# Altium schematic sheet xpoint.SchDoc
size A3
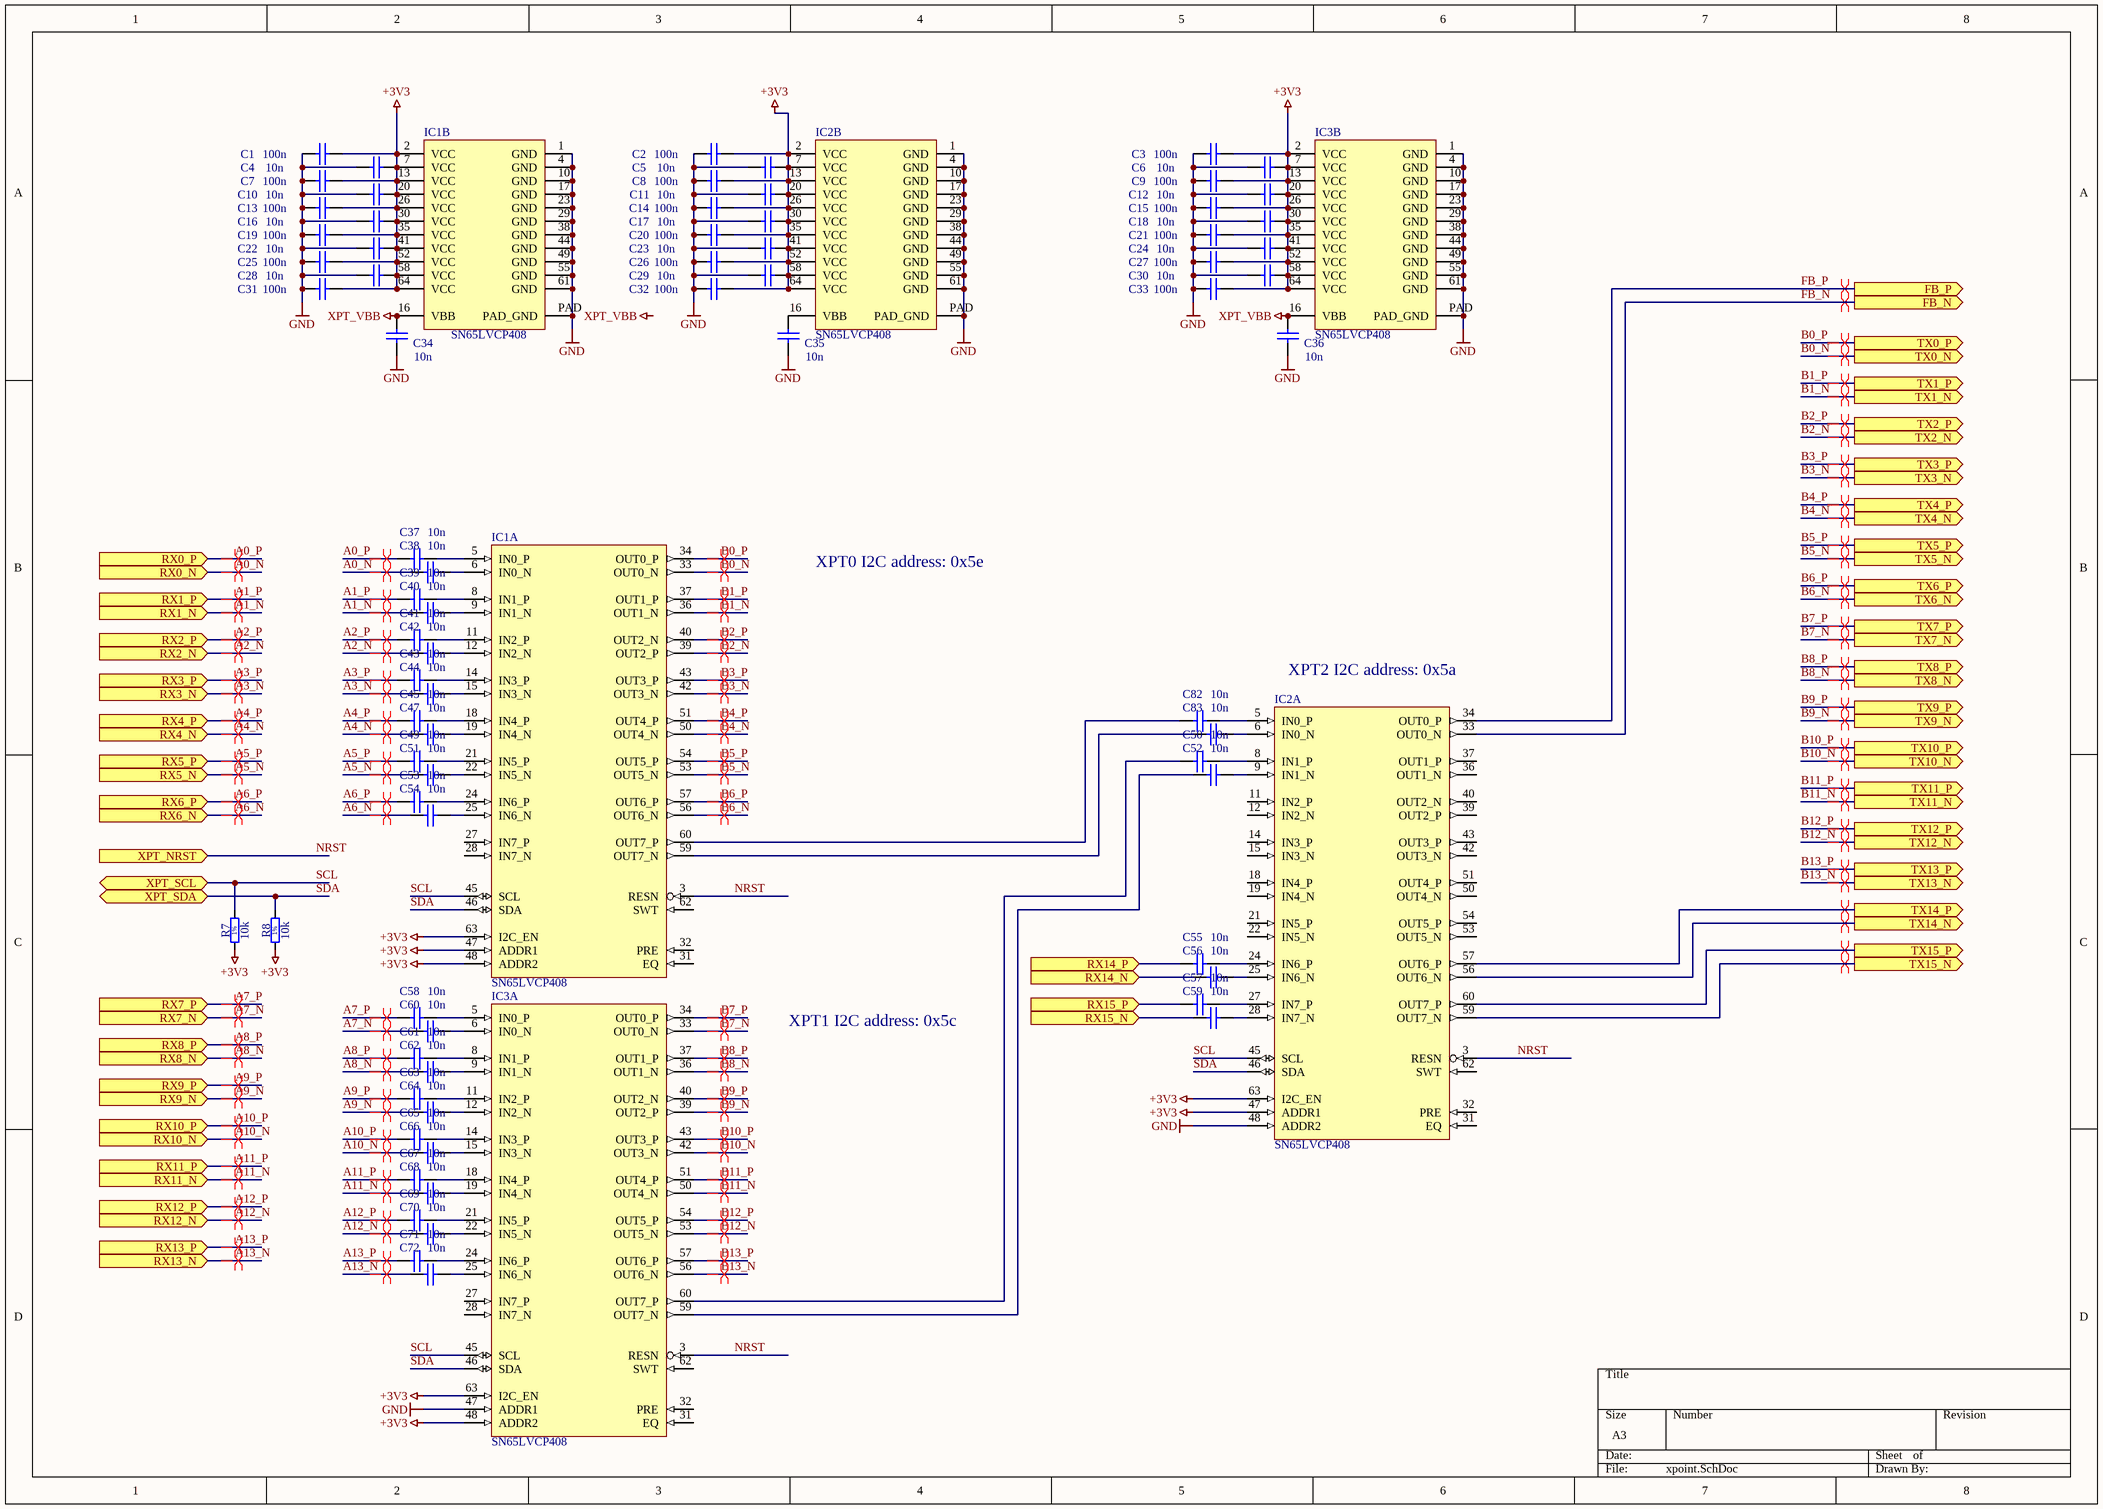
[diagram p0: xpoint.SchDoc]

## Parts
C1  100n  [CAPC1608X87N]
C2  100n  [CAPC1608X87N]
C3  100n  [CAPC1608X87N]
C4  10n  [CAPC1608X87N]
C5  10n  [CAPC1608X87N]
C6  10n  [CAPC1608X87N]
C7  100n  [CAPC1608X87N]
C8  100n  [CAPC1608X87N]
C9  100n  [CAPC1608X87N]
C10  10n  [CAPC1608X87N]
C11  10n  [CAPC1608X87N]
C12  10n  [CAPC1608X87N]
C13  100n  [CAPC1608X87N]
C14  100n  [CAPC1608X87N]
C15  100n  [CAPC1608X87N]
C16  10n  [CAPC1608X87N]
C17  10n  [CAPC1608X87N]
C18  10n  [CAPC1608X87N]
C19  100n  [CAPC1608X87N]
C20  100n  [CAPC1608X87N]
C21  100n  [CAPC1608X87N]
C22  10n  [CAPC1608X87N]
C23  10n  [CAPC1608X87N]
C24  10n  [CAPC1608X87N]
C25  100n  [CAPC1608X87N]
C26  100n  [CAPC1608X87N]
C27  100n  [CAPC1608X87N]
C28  10n  [CAPC1608X87N]
C29  10n  [CAPC1608X87N]
C30  10n  [CAPC1608X87N]
C31  100n  [CAPC1608X87N]
C32  100n  [CAPC1608X87N]
C33  100n  [CAPC1608X87N]
C34  10n  [CAPC1608X87N]
C35  10n  [CAPC1608X87N]
C36  10n  [CAPC1608X87N]
C37  10n  [CAPC1608X87N]
C38  10n  [CAPC1608X87N]
C39  10n  [CAPC1608X87N]
C40  10n  [CAPC1608X87N]
C41  10n  [CAPC1608X87N]
C42  10n  [CAPC1608X87N]
C43  10n  [CAPC1608X87N]
C44  10n  [CAPC1608X87N]
C45  10n  [CAPC1608X87N]
C47  10n  [CAPC1608X87N]
C49  10n  [CAPC1608X87N]
C50  10n  [CAPC1608X87N]
C51  10n  [CAPC1608X87N]
C52  10n  [CAPC1608X87N]
C53  10n  [CAPC1608X87N]
C54  10n  [CAPC1608X87N]
C55  10n  [CAPC1608X87N]
C56  10n  [CAPC1608X87N]
C57  10n  [CAPC1608X87N]
C58  10n  [CAPC1608X87N]
C59  10n  [CAPC1608X87N]
C60  10n  [CAPC1608X87N]
C61  10n  [CAPC1608X87N]
C62  10n  [CAPC1608X87N]
C63  10n  [CAPC1608X87N]
C64  10n  [CAPC1608X87N]
C65  10n  [CAPC1608X87N]
C66  10n  [CAPC1608X87N]
C67  10n  [CAPC1608X87N]
C68  10n  [CAPC1608X87N]
C69  10n  [CAPC1608X87N]
C70  10n  [CAPC1608X87N]
C71  10n  [CAPC1608X87N]
C72  10n  [CAPC1608X87N]
C82  10n  [CAPC1608X87N]
C83  10n  [CAPC1608X87N]
IC1  SN65LVCP408  [HTQFP64]  (parts A,B of 2)
IC2  SN65LVCP408  [HTQFP64]  (parts A,B of 2)
IC3  SN65LVCP408  [HTQFP64]  (parts A,B of 2)
R7  10k  [RESC1608X55N]
R8  10k  [RESC1608X55N]

## Ports
FB_N (out), FB_P (out), RX0_N (in), RX0_P (in), RX1_N (in), RX1_P (in), RX2_N (in), RX2_P (in), RX3_N (in), RX3_P (in), RX4_N (in), RX4_P (in), RX5_N (in), RX5_P (in), RX6_N (in), RX6_P (in), RX7_N (in), RX7_P (in), RX8_N (in), RX8_P (in), RX9_N (in), RX9_P (in), RX10_N (in), RX10_P (in), RX11_N (in), RX11_P (in), RX12_N (in), RX12_P (in), RX13_N (in), RX13_P (in), RX14_N (in), RX14_P (in), RX15_N (in), RX15_P (in), TX0_N (out), TX0_P (out), TX1_N (out), TX1_P (out), TX2_N (out), TX2_P (out), TX3_N (out), TX3_P (out), TX4_N (out), TX4_P (out), TX5_N (out), TX5_P (out), TX6_N (out), TX6_P (out), TX7_N (out), TX7_P (out), TX8_N (out), TX8_P (out), TX9_N (out), TX9_P (out), TX10_N (out), TX10_P (out), TX11_N (out), TX11_P (out), TX12_N (out), TX12_P (out), TX13_N (out), TX13_P (out), TX14_N (out), TX14_P (out), TX15_N (out), TX15_P (out), XPT_NRST (in), XPT_SCL (bidir), XPT_SDA (bidir)

## Nets
+3V3: C1.2 C2.2 C3.2 C4.2 C5.2 C6.2 C7.2 C8.2 C9.2 C10.2 C11.2 C12.2 C13.2 C14.2 C15.2 C16.2 C17.2 C18.2 C19.2 C20.2 C21.2 C22.2 C23.2 C24.2 C25.2 C26.2 C27.2 C28.2 C29.2 C30.2 C31.2 C32.2 C33.2 IC1.2(VCC) IC1.7(VCC) IC1.13(VCC) IC1.20(VCC) IC1.26(VCC) IC1.30(VCC) IC1.35(VCC) IC1.41(VCC) IC1.47(ADDR1) IC1.48(ADDR2) IC1.52(VCC) IC1.58(VCC) IC1.63(I2C_EN) IC1.64(VCC) IC2.2(VCC) IC2.7(VCC) IC2.13(VCC) IC2.20(VCC) IC2.26(VCC) IC2.30(VCC) IC2.35(VCC) IC2.41(VCC) IC2.47(ADDR1) IC2.52(VCC) IC2.58(VCC) IC2.63(I2C_EN) IC2.64(VCC) IC3.2(VCC) IC3.7(VCC) IC3.13(VCC) IC3.20(VCC) IC3.26(VCC) IC3.30(VCC) IC3.35(VCC) IC3.41(VCC) IC3.48(ADDR2) IC3.52(VCC) IC3.58(VCC) IC3.63(I2C_EN) IC3.64(VCC) R7.1 R8.1
GND: C1.1 C2.1 C3.1 C4.1 C5.1 C6.1 C7.1 C8.1 C9.1 C10.1 C11.1 C12.1 C13.1 C14.1 C15.1 C16.1 C17.1 C18.1 C19.1 C20.1 C21.1 C22.1 C23.1 C24.1 C25.1 C26.1 C27.1 C28.1 C29.1 C30.1 C31.1 C32.1 C33.1 C34.1 C35.1 C36.1 IC1.1(GND) IC1.4(GND) IC1.10(GND) IC1.17(GND) IC1.23(GND) IC1.29(GND) IC1.38(GND) IC1.44(GND) IC1.49(GND) IC1.55(GND) IC1.61(GND) IC1.PAD(PAD_GND) IC2.1(GND) IC2.4(GND) IC2.10(GND) IC2.17(GND) IC2.23(GND) IC2.29(GND) IC2.38(GND) IC2.44(GND) IC2.48(ADDR2) IC2.49(GND) IC2.55(GND) IC2.61(GND) IC2.PAD(PAD_GND) IC3.1(GND) IC3.4(GND) IC3.10(GND) IC3.17(GND) IC3.23(GND) IC3.29(GND) IC3.38(GND) IC3.44(GND) IC3.47(ADDR1) IC3.49(GND) IC3.55(GND) IC3.61(GND) IC3.PAD(PAD_GND)
XPT_VBB: C34.2 C36.2 IC1.16(VBB) IC3.16(VBB)
A0_N: C38.1 ; port RX0_N
A0_P: C37.1 ; port RX0_P
A1_N: C40.1 ; port RX1_N
A1_P: C39.1 ; port RX1_P
A2_N: C42.1 ; port RX2_N
A2_P: C41.1 ; port RX2_P
A3_N: C44.1 ; port RX3_N
A3_P: C43.1 ; port RX3_P
A4_N: C47.1 ; port RX4_N
A4_P: C45.1 ; port RX4_P
A5_N: C51.1 ; port RX5_N
A5_P: C49.1 ; port RX5_P
A6_N: C54.1 ; port RX6_N
A6_P: C53.1 ; port RX6_P
A7_N: C60.1 ; port RX7_N
A7_P: C58.1 ; port RX7_P
A8_N: C62.1 ; port RX8_N
A8_P: C61.1 ; port RX8_P
A9_N: C64.1 ; port RX9_N
A9_P: C63.1 ; port RX9_P
A10_N: C66.1 ; port RX10_N
A10_P: C65.1 ; port RX10_P
A11_N: C68.1 ; port RX11_N
A11_P: C67.1 ; port RX11_P
A12_N: C70.1 ; port RX12_N
A12_P: C69.1 ; port RX12_P
A13_N: C72.1 ; port RX13_N
A13_P: C71.1 ; port RX13_P
B0_N: IC1.33(OUT0_N) ; port TX0_N
B0_P: IC1.34(OUT0_P) ; port TX0_P
B1_N: IC1.36(OUT1_N) ; port TX1_N
B1_P: IC1.37(OUT1_P) ; port TX1_P
B2_N: IC1.39(OUT2_P) ; port TX2_N
B2_P: IC1.40(OUT2_N) ; port TX2_P
B3_N: IC1.42(OUT3_N) ; port TX3_N
B3_P: IC1.43(OUT3_P) ; port TX3_P
B4_N: IC1.50(OUT4_N) ; port TX4_N
B4_P: IC1.51(OUT4_P) ; port TX4_P
B5_N: IC1.53(OUT5_N) ; port TX5_N
B5_P: IC1.54(OUT5_P) ; port TX5_P
B6_N: IC1.56(OUT6_N) ; port TX6_N
B6_P: IC1.57(OUT6_P) ; port TX6_P
B7_N: IC3.33(OUT0_N) ; port TX7_N
B7_P: IC3.34(OUT0_P) ; port TX7_P
B8_N: IC3.36(OUT1_N) ; port TX8_N
B8_P: IC3.37(OUT1_P) ; port TX8_P
B9_N: IC3.39(OUT2_P) ; port TX9_N
B9_P: IC3.40(OUT2_N) ; port TX9_P
B10_N: IC3.42(OUT3_N) ; port TX10_N
B10_P: IC3.43(OUT3_P) ; port TX10_P
B11_N: IC3.50(OUT4_N) ; port TX11_N
B11_P: IC3.51(OUT4_P) ; port TX11_P
B12_N: IC3.53(OUT5_N) ; port TX12_N
B12_P: IC3.54(OUT5_P) ; port TX12_P
B13_N: IC3.56(OUT6_N) ; port TX13_N
B13_P: IC3.57(OUT6_P) ; port TX13_P
FB_N: IC2.33(OUT0_N) ; port FB_N
FB_P: IC2.34(OUT0_P) ; port FB_P
NRST: IC1.3(RESN) IC2.3(RESN) IC3.3(RESN) ; port XPT_NRST
RX14_N: C56.1 ; port RX14_N
RX14_P: C55.1 ; port RX14_P
RX15_N: C59.1 ; port RX15_N
RX15_P: C57.1 ; port RX15_P
SCL: IC1.45(SCL) IC2.45(SCL) IC3.45(SCL) R7.2 ; port XPT_SCL
SDA: IC1.46(SDA) IC2.46(SDA) IC3.46(SDA) R8.2 ; port XPT_SDA
TX14_N: IC2.56(OUT6_N) ; port TX14_N
TX14_P: IC2.57(OUT6_P) ; port TX14_P
TX15_N: IC2.59(OUT7_N) ; port TX15_N
TX15_P: IC2.60(OUT7_P) ; port TX15_P
NetC35_2: C35.2 IC2.16(VBB)
NetC37_2: C37.2 IC1.5(IN0_P)
NetC38_2: C38.2 IC1.6(IN0_N)
NetC39_2: C39.2 IC1.8(IN1_P)
NetC40_2: C40.2 IC1.9(IN1_N)
NetC41_2: C41.2 IC1.11(IN2_P)
NetC42_2: C42.2 IC1.12(IN2_N)
NetC43_2: C43.2 IC1.14(IN3_P)
NetC44_2: C44.2 IC1.15(IN3_N)
NetC45_2: C45.2 IC1.18(IN4_P)
NetC47_2: C47.2 IC1.19(IN4_N)
NetC49_2: C49.2 IC1.21(IN5_P)
NetC50_1: C50.1 IC3.60(OUT7_P)
NetC50_2: C50.2 IC2.8(IN1_P)
NetC51_2: C51.2 IC1.22(IN5_N)
NetC52_1: C52.1 IC3.59(OUT7_N)
NetC52_2: C52.2 IC2.9(IN1_N)
NetC53_2: C53.2 IC1.24(IN6_P)
NetC54_2: C54.2 IC1.25(IN6_N)
NetC55_2: C55.2 IC2.24(IN6_P)
NetC56_2: C56.2 IC2.25(IN6_N)
NetC57_2: C57.2 IC2.27(IN7_P)
NetC58_2: C58.2 IC3.5(IN0_P)
NetC59_2: C59.2 IC2.28(IN7_N)
NetC60_2: C60.2 IC3.6(IN0_N)
NetC61_2: C61.2 IC3.8(IN1_P)
NetC62_2: C62.2 IC3.9(IN1_N)
NetC63_2: C63.2 IC3.11(IN2_P)
NetC64_2: C64.2 IC3.12(IN2_N)
NetC65_2: C65.2 IC3.14(IN3_P)
NetC66_2: C66.2 IC3.15(IN3_N)
NetC67_2: C67.2 IC3.18(IN4_P)
NetC68_2: C68.2 IC3.19(IN4_N)
NetC69_2: C69.2 IC3.21(IN5_P)
NetC70_2: C70.2 IC3.22(IN5_N)
NetC71_2: C71.2 IC3.24(IN6_P)
NetC72_2: C72.2 IC3.25(IN6_N)
NetC82_1: C82.1 IC1.60(OUT7_P)
NetC82_2: C82.2 IC2.5(IN0_P)
NetC83_1: C83.1 IC1.59(OUT7_N)
NetC83_2: C83.2 IC2.6(IN0_N)

Not connected (* = marked no-connect by the designer): IC1 27(IN7_P) 28(IN7_N) 31(EQ) 32(PRE) 62(SWT); IC2 11(IN2_P) 12(IN2_N) 14(IN3_P) 15(IN3_N) 18(IN4_P) 19(IN4_N) 21(IN5_P) 22(IN5_N) 31(EQ) 32(PRE) 36(OUT1_N) 37(OUT1_P) 39(OUT2_P) 40(OUT2_N) 42(OUT3_N) 43(OUT3_P) 50(OUT4_N) 51(OUT4_P) 53(OUT5_N) 54(OUT5_P) 62(SWT); IC3 27(IN7_P) 28(IN7_N) 31(EQ) 32(PRE) 62(SWT)

## Layout directives
differential pair: A0_N, A0_P, A1_N, A1_P, A2_N, A2_P, A3_N, A3_P, A4_N, A4_P, A5_N, A5_P, A6_N, A6_P, A7_N, A7_P, A8_N, A8_P, A9_N, A9_P, A10_N, A10_P, A11_N, A11_P, A12_N, A12_P, A13_N, A13_P, B0_N, B0_P, B1_N, B1_P, B2_N, B2_P, B3_N, B3_P, B4_N, B4_P, B5_N, B5_P, B6_N, B6_P, B7_N, B7_P, B8_N, B8_P, B9_N, B9_P, B10_N, B10_P, B11_N, B11_P, B12_N, B12_P, B13_N, B13_P, FB_N, FB_P, TX14_N, TX14_P, TX15_N, TX15_P

## Notes on the sheet
- XPT0 I2C address: 0x5e
- (near IC2) XPT2 I2C address: 0x5a
- XPT1 I2C address: 0x5c
- Labels drawn without touching a wire or pin: XPT_VBB
- (in symbol R0603_10K_1%_0.1W_100PPM) 1%

## Library data of the parts
C1-C3 C7-C9 C13-C15 C19-C21 C25-C27 C31-C33 = CC0603_100NF_50V_10%_X7R: Non-polarised capacitor; Part Description: SMD Multilayer Chip Ceramic Capacitor; Manufacturer: GENERIC; Manufacturer1 Part Number: 223858615649; Value: 100nF; Voltage: 50V; TC: X7R; Tolerance: ±10%; Table: Capacitors SMD; Part Number: CC0603_100NF_50V_10%_X7R; Component Kind: Standard; Component Type: Standard; Pin Count: 2; Status: Preferred; Manufacturer Part Number: CC0603_100NF_50V_10%_X7R; Case: 0603; Mounted: Yes; Socket: No; SMD: Yes; Manufacturer1 Example: PHYCOMP; Manufacturer1 ComponentHeight: 0.87mm; HelpURL: \\cern.ch\dfs\Applications\Altium\Datasheets\CC0603_X7R_PHYCOMP.pdf; Author: CERN DEM JLC; CreateDate: 12/3/2007; LatestRevisionDate: 12/3/2007
C4-C6 C10-C12 C16-C18 C22-C24 C28-C30 C34-C45 C47 C49-C72 C82 C83 = CC0603_10NF_50V_10%_X7R: Non-polarised capacitor; Part Description: SMD Multilayer Chip Ceramic Capacitor; Manufacturer: GENERIC; Manufacturer1 Part Number: 223858615636; Value: 10nF; Voltage: 50V; TC: X7R; Tolerance: ±10%; Table: Capacitors SMD; Part Number: CC0603_10NF_50V_10%_X7R; Component Kind: Standard; Component Type: Standard; Pin Count: 2; Status: Preferred; Manufacturer Part Number: CC0603_10NF_50V_10%_X7R; Case: 0603; Mounted: Yes; Socket: No; SMD: Yes; Manufacturer1 Example: PHYCOMP; Manufacturer1 ComponentHeight: 0.87mm; HelpURL: \\cern.ch\dfs\Applications\Altium\Datasheets\CC0603_X7R_PHYCOMP.pdf; Author: CERN DEM JLC; CreateDate: 12/3/2007; LatestRevisionDate: 12/3/2007
IC1-IC3 = SN65LVCP408: TI 8x8 gigabit crosspoint
R7 R8 = R0603_10K_1%_0.1W_100PPM: Resistor - 1%; Part Description: General Purpose Thick Film Chip Resistor; Manufacturer: GENERIC; Manufacturer1 Part Number: NRC06F1002TRF; Power: 0.1W; TC: ±100ppm/°C; Table: Resistors SMD; Part Number: R0603_10K_1%_0.1W_100PPM; Component Kind: Standard; Component Type: Standard; Pin Count: 2; Value: 10k; Status: Preferred; Tolerance: ±1%; Manufacturer Part Number: R0603_10K_1%_0.1W_100PPM; Case: 0603; Mounted: Yes; Socket: No; SMD: Yes; Manufacturer1 Example: NIC COMPONENT; Manufacturer1 ComponentHeight: 0.55mm; HelpURL: \\cern.ch\dfs\Applications\Altium\Datasheets\R0603_NIC_NRC.pdf; Author: CERN DEM JLC; CreateDate: 12/3/2007; LatestRevisionDate: 3/13/2008